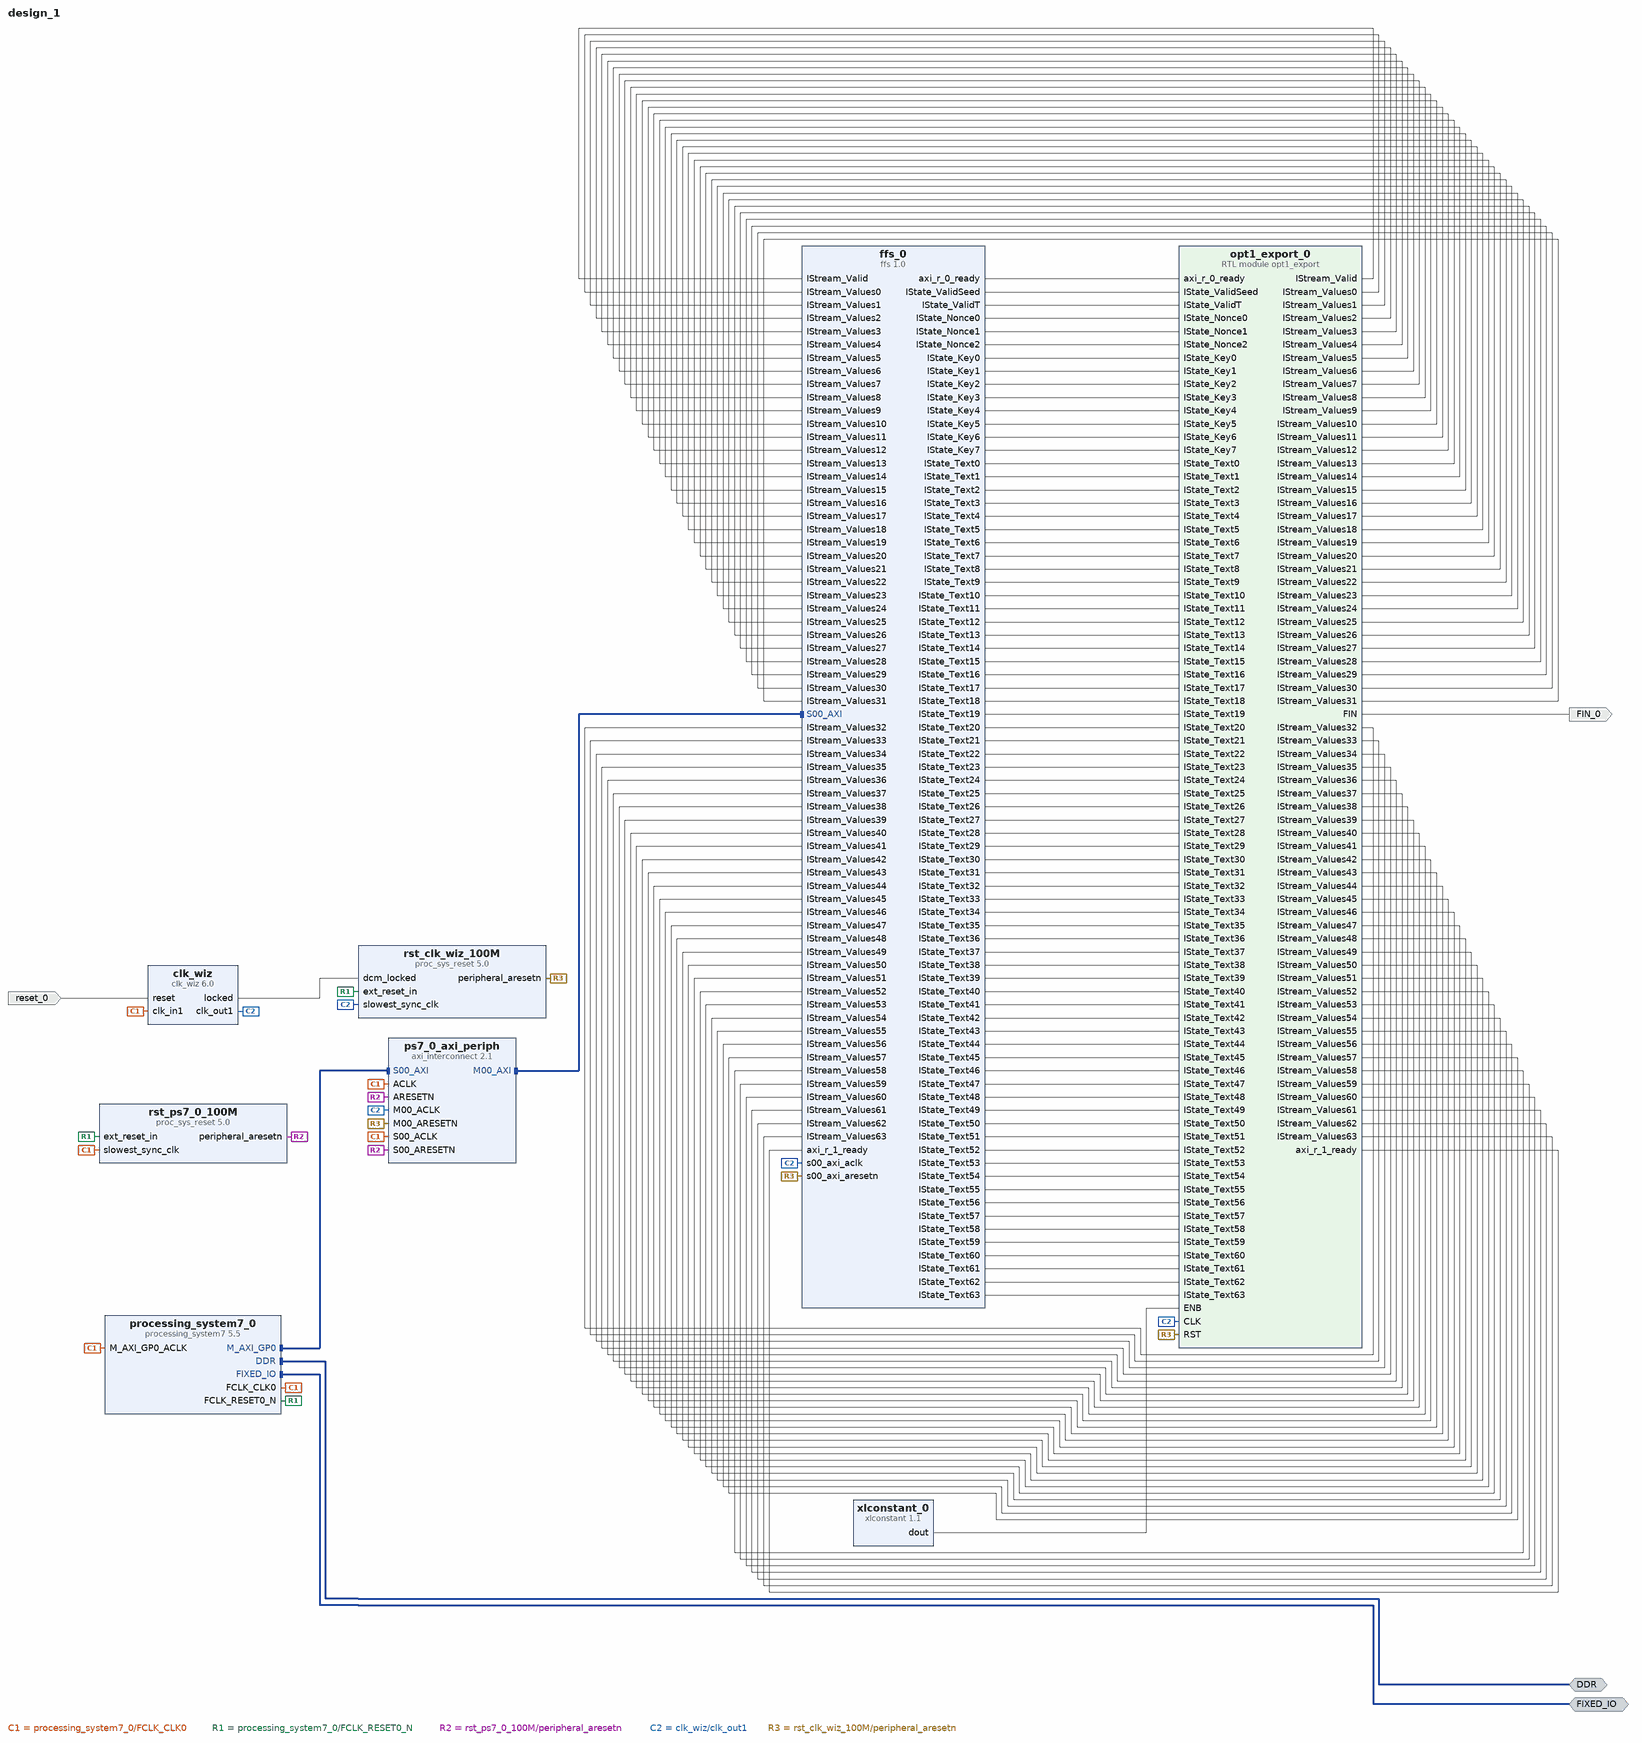
[diagram p0: block diagram of the top level]
# Vivado block design design_1, xc7z020clg484-1, Vivado 2020.2
create_bd_design design_1

create_bd_intf_port -mode Master -vlnv xilinx.com:interface:ddrx_rtl:1.0 DDR
create_bd_intf_port -mode Master -vlnv xilinx.com:display_processing_system7:fixedio_rtl:1.0 FIXED_IO
create_bd_port -dir O FIN_0
create_bd_port -dir I -type rst reset_0
set_property -dict {CONFIG.POLARITY ACTIVE_HIGH} [get_bd_ports reset_0]

create_bd_cell -type ip -vlnv user.org:user:ffs:1.0 ffs_0
create_bd_cell -type module -reference opt1_export opt1_export_0
create_bd_cell -type ip -vlnv xilinx.com:ip:xlconstant:1.1 xlconstant_0
create_bd_cell -type ip -vlnv xilinx.com:ip:processing_system7:5.5 processing_system7_0
set_property -dict [list \
  CONFIG.PCW_APU_PERIPHERAL_FREQMHZ 666.666667 \
  CONFIG.PCW_ENET0_ENET0_IO {MIO 16 .. 27} \
  CONFIG.PCW_ENET0_GRP_MDIO_ENABLE 1 \
  CONFIG.PCW_ENET0_GRP_MDIO_IO {MIO 52 .. 53} \
  CONFIG.PCW_ENET0_PERIPHERAL_ENABLE 1 \
  CONFIG.PCW_ENET0_RESET_ENABLE 0 \
  CONFIG.PCW_ENET_RESET_ENABLE 1 \
  CONFIG.PCW_ENET_RESET_SELECT {Share reset pin} \
  CONFIG.PCW_FPGA0_PERIPHERAL_FREQMHZ 100.000000 \
  CONFIG.PCW_FPGA1_PERIPHERAL_FREQMHZ 150.000000 \
  CONFIG.PCW_FPGA2_PERIPHERAL_FREQMHZ 50.000000 \
  CONFIG.PCW_GPIO_MIO_GPIO_ENABLE 1 \
  CONFIG.PCW_GPIO_MIO_GPIO_IO MIO \
  CONFIG.PCW_I2C_RESET_ENABLE 1 \
  CONFIG.PCW_PRESET_BANK1_VOLTAGE {LVCMOS 1.8V} \
  CONFIG.PCW_QSPI_GRP_SINGLE_SS_ENABLE 1 \
  CONFIG.PCW_QSPI_GRP_SINGLE_SS_IO {MIO 1 .. 6} \
  CONFIG.PCW_QSPI_PERIPHERAL_ENABLE 1 \
  CONFIG.PCW_QSPI_PERIPHERAL_FREQMHZ 200.000000 \
  CONFIG.PCW_QSPI_QSPI_IO {MIO 1 .. 6} \
  CONFIG.PCW_SD0_GRP_CD_ENABLE 1 \
  CONFIG.PCW_SD0_GRP_CD_IO {MIO 47} \
  CONFIG.PCW_SD0_GRP_WP_ENABLE 1 \
  CONFIG.PCW_SD0_GRP_WP_IO {MIO 46} \
  CONFIG.PCW_SD0_PERIPHERAL_ENABLE 1 \
  CONFIG.PCW_SD0_SD0_IO {MIO 40 .. 45} \
  CONFIG.PCW_SDIO_PERIPHERAL_FREQMHZ 50 \
  CONFIG.PCW_SINGLE_QSPI_DATA_MODE x4 \
  CONFIG.PCW_TTC0_PERIPHERAL_ENABLE 1 \
  CONFIG.PCW_TTC0_TTC0_IO EMIO \
  CONFIG.PCW_UART1_PERIPHERAL_ENABLE 1 \
  CONFIG.PCW_UART1_UART1_IO {MIO 48 .. 49} \
  CONFIG.PCW_UART_PERIPHERAL_FREQMHZ 50 \
  CONFIG.PCW_UIPARAM_DDR_FREQ_MHZ 533.333313 \
  CONFIG.PCW_UIPARAM_DDR_PARTNO {MT41J128M16 HA-15E} \
  CONFIG.PCW_USB0_PERIPHERAL_ENABLE 1 \
  CONFIG.PCW_USB0_RESET_ENABLE 0 \
  CONFIG.PCW_USB0_USB0_IO {MIO 28 .. 39} \
  CONFIG.PCW_USB_RESET_ENABLE 1 \
  CONFIG.PCW_USB_RESET_SELECT {Share reset pin} \
  CONFIG.preset ZedBoard \
] [get_bd_cells processing_system7_0]
# 221 more settings of processing_system7_0 are not shown: defaults, MIO pin electricals, DDR timing, and values the tool derives
create_bd_cell -type ip -vlnv xilinx.com:ip:axi_interconnect:2.1 ps7_0_axi_periph
set_property -dict {CONFIG.NUM_MI 1} [get_bd_cells ps7_0_axi_periph]
create_bd_cell -type ip -vlnv xilinx.com:ip:clk_wiz:6.0 clk_wiz
set_property -dict [list \
  CONFIG.CLKOUT1_JITTER 159.371 \
  CONFIG.CLKOUT1_PHASE_ERROR 98.575 \
  CONFIG.CLKOUT1_REQUESTED_OUT_FREQ 40 \
  CONFIG.MMCM_CLKFBOUT_MULT_F 10.000 \
  CONFIG.MMCM_CLKOUT0_DIVIDE_F 25.000 \
  CONFIG.MMCM_DIVCLK_DIVIDE 1 \
] [get_bd_cells clk_wiz]
create_bd_cell -type ip -vlnv xilinx.com:ip:proc_sys_reset:5.0 rst_ps7_0_100M
create_bd_cell -type ip -vlnv xilinx.com:ip:proc_sys_reset:5.0 rst_clk_wiz_100M

# ---- connections ----

connect_bd_intf_net [get_bd_intf_ports FIXED_IO] [get_bd_intf_pins processing_system7_0/FIXED_IO]
connect_bd_intf_net [get_bd_intf_ports DDR] [get_bd_intf_pins processing_system7_0/DDR]
connect_bd_intf_net [get_bd_intf_pins processing_system7_0/M_AXI_GP0] [get_bd_intf_pins ps7_0_axi_periph/S00_AXI]
connect_bd_intf_net [get_bd_intf_pins ps7_0_axi_periph/M00_AXI] [get_bd_intf_pins ffs_0/S00_AXI]
connect_bd_net [get_bd_pins ffs_0/axi_r_0_ready] [get_bd_pins opt1_export_0/axi_r_0_ready]
connect_bd_net [get_bd_pins opt1_export_0/IStream_Valid] [get_bd_pins ffs_0/IStream_Valid]
connect_bd_net [get_bd_pins opt1_export_0/IStream_Values0] [get_bd_pins ffs_0/IStream_Values0]
connect_bd_net [get_bd_pins opt1_export_0/IStream_Values1] [get_bd_pins ffs_0/IStream_Values1]
connect_bd_net [get_bd_pins opt1_export_0/IStream_Values2] [get_bd_pins ffs_0/IStream_Values2]
connect_bd_net [get_bd_pins opt1_export_0/IStream_Values3] [get_bd_pins ffs_0/IStream_Values3]
connect_bd_net [get_bd_pins opt1_export_0/IStream_Values4] [get_bd_pins ffs_0/IStream_Values4]
connect_bd_net [get_bd_pins opt1_export_0/IStream_Values5] [get_bd_pins ffs_0/IStream_Values5]
connect_bd_net [get_bd_pins opt1_export_0/IStream_Values6] [get_bd_pins ffs_0/IStream_Values6]
connect_bd_net [get_bd_pins opt1_export_0/IStream_Values7] [get_bd_pins ffs_0/IStream_Values7]
connect_bd_net [get_bd_pins opt1_export_0/IStream_Values8] [get_bd_pins ffs_0/IStream_Values8]
connect_bd_net [get_bd_pins opt1_export_0/IStream_Values9] [get_bd_pins ffs_0/IStream_Values9]
connect_bd_net [get_bd_pins opt1_export_0/IStream_Values10] [get_bd_pins ffs_0/IStream_Values10]
connect_bd_net [get_bd_pins opt1_export_0/IStream_Values11] [get_bd_pins ffs_0/IStream_Values11]
connect_bd_net [get_bd_pins opt1_export_0/IStream_Values12] [get_bd_pins ffs_0/IStream_Values12]
connect_bd_net [get_bd_pins opt1_export_0/IStream_Values13] [get_bd_pins ffs_0/IStream_Values13]
connect_bd_net [get_bd_pins opt1_export_0/IStream_Values14] [get_bd_pins ffs_0/IStream_Values14]
connect_bd_net [get_bd_pins opt1_export_0/IStream_Values15] [get_bd_pins ffs_0/IStream_Values15]
connect_bd_net [get_bd_pins opt1_export_0/IStream_Values16] [get_bd_pins ffs_0/IStream_Values16]
connect_bd_net [get_bd_pins opt1_export_0/IStream_Values17] [get_bd_pins ffs_0/IStream_Values17]
connect_bd_net [get_bd_pins opt1_export_0/IStream_Values18] [get_bd_pins ffs_0/IStream_Values18]
connect_bd_net [get_bd_pins opt1_export_0/IStream_Values19] [get_bd_pins ffs_0/IStream_Values19]
connect_bd_net [get_bd_pins opt1_export_0/IStream_Values20] [get_bd_pins ffs_0/IStream_Values20]
connect_bd_net [get_bd_pins opt1_export_0/IStream_Values21] [get_bd_pins ffs_0/IStream_Values21]
connect_bd_net [get_bd_pins opt1_export_0/IStream_Values22] [get_bd_pins ffs_0/IStream_Values22]
connect_bd_net [get_bd_pins opt1_export_0/IStream_Values23] [get_bd_pins ffs_0/IStream_Values23]
connect_bd_net [get_bd_pins opt1_export_0/IStream_Values24] [get_bd_pins ffs_0/IStream_Values24]
connect_bd_net [get_bd_pins opt1_export_0/IStream_Values25] [get_bd_pins ffs_0/IStream_Values25]
connect_bd_net [get_bd_pins opt1_export_0/IStream_Values26] [get_bd_pins ffs_0/IStream_Values26]
connect_bd_net [get_bd_pins opt1_export_0/IStream_Values27] [get_bd_pins ffs_0/IStream_Values27]
connect_bd_net [get_bd_pins opt1_export_0/IStream_Values28] [get_bd_pins ffs_0/IStream_Values28]
connect_bd_net [get_bd_pins opt1_export_0/IStream_Values29] [get_bd_pins ffs_0/IStream_Values29]
connect_bd_net [get_bd_pins opt1_export_0/IStream_Values30] [get_bd_pins ffs_0/IStream_Values30]
connect_bd_net [get_bd_pins opt1_export_0/IStream_Values31] [get_bd_pins ffs_0/IStream_Values31]
connect_bd_net [get_bd_pins opt1_export_0/IStream_Values32] [get_bd_pins ffs_0/IStream_Values32]
connect_bd_net [get_bd_pins opt1_export_0/IStream_Values33] [get_bd_pins ffs_0/IStream_Values33]
connect_bd_net [get_bd_pins opt1_export_0/IStream_Values34] [get_bd_pins ffs_0/IStream_Values34]
connect_bd_net [get_bd_pins opt1_export_0/IStream_Values35] [get_bd_pins ffs_0/IStream_Values35]
connect_bd_net [get_bd_pins opt1_export_0/IStream_Values36] [get_bd_pins ffs_0/IStream_Values36]
connect_bd_net [get_bd_pins opt1_export_0/IStream_Values37] [get_bd_pins ffs_0/IStream_Values37]
connect_bd_net [get_bd_pins opt1_export_0/IStream_Values38] [get_bd_pins ffs_0/IStream_Values38]
connect_bd_net [get_bd_pins opt1_export_0/IStream_Values39] [get_bd_pins ffs_0/IStream_Values39]
connect_bd_net [get_bd_pins opt1_export_0/IStream_Values40] [get_bd_pins ffs_0/IStream_Values40]
connect_bd_net [get_bd_pins opt1_export_0/IStream_Values41] [get_bd_pins ffs_0/IStream_Values41]
connect_bd_net [get_bd_pins opt1_export_0/IStream_Values42] [get_bd_pins ffs_0/IStream_Values42]
connect_bd_net [get_bd_pins opt1_export_0/IStream_Values43] [get_bd_pins ffs_0/IStream_Values43]
connect_bd_net [get_bd_pins opt1_export_0/IStream_Values44] [get_bd_pins ffs_0/IStream_Values44]
connect_bd_net [get_bd_pins opt1_export_0/IStream_Values45] [get_bd_pins ffs_0/IStream_Values45]
connect_bd_net [get_bd_pins opt1_export_0/IStream_Values46] [get_bd_pins ffs_0/IStream_Values46]
connect_bd_net [get_bd_pins opt1_export_0/IStream_Values47] [get_bd_pins ffs_0/IStream_Values47]
connect_bd_net [get_bd_pins opt1_export_0/IStream_Values48] [get_bd_pins ffs_0/IStream_Values48]
connect_bd_net [get_bd_pins opt1_export_0/IStream_Values49] [get_bd_pins ffs_0/IStream_Values49]
connect_bd_net [get_bd_pins opt1_export_0/IStream_Values50] [get_bd_pins ffs_0/IStream_Values50]
connect_bd_net [get_bd_pins opt1_export_0/IStream_Values51] [get_bd_pins ffs_0/IStream_Values51]
connect_bd_net [get_bd_pins opt1_export_0/IStream_Values52] [get_bd_pins ffs_0/IStream_Values52]
connect_bd_net [get_bd_pins opt1_export_0/IStream_Values53] [get_bd_pins ffs_0/IStream_Values53]
connect_bd_net [get_bd_pins opt1_export_0/IStream_Values54] [get_bd_pins ffs_0/IStream_Values54]
connect_bd_net [get_bd_pins opt1_export_0/IStream_Values55] [get_bd_pins ffs_0/IStream_Values55]
connect_bd_net [get_bd_pins opt1_export_0/IStream_Values56] [get_bd_pins ffs_0/IStream_Values56]
connect_bd_net [get_bd_pins opt1_export_0/IStream_Values57] [get_bd_pins ffs_0/IStream_Values57]
connect_bd_net [get_bd_pins opt1_export_0/IStream_Values58] [get_bd_pins ffs_0/IStream_Values58]
connect_bd_net [get_bd_pins opt1_export_0/IStream_Values59] [get_bd_pins ffs_0/IStream_Values59]
connect_bd_net [get_bd_pins opt1_export_0/IStream_Values60] [get_bd_pins ffs_0/IStream_Values60]
connect_bd_net [get_bd_pins opt1_export_0/IStream_Values61] [get_bd_pins ffs_0/IStream_Values61]
connect_bd_net [get_bd_pins opt1_export_0/IStream_Values62] [get_bd_pins ffs_0/IStream_Values62]
connect_bd_net [get_bd_pins opt1_export_0/IStream_Values63] [get_bd_pins ffs_0/IStream_Values63]
connect_bd_net [get_bd_pins ffs_0/IState_ValidSeed] [get_bd_pins opt1_export_0/IState_ValidSeed]
connect_bd_net [get_bd_pins ffs_0/IState_ValidT] [get_bd_pins opt1_export_0/IState_ValidT]
connect_bd_net [get_bd_pins ffs_0/IState_Nonce0] [get_bd_pins opt1_export_0/IState_Nonce0]
connect_bd_net [get_bd_pins ffs_0/IState_Nonce1] [get_bd_pins opt1_export_0/IState_Nonce1]
connect_bd_net [get_bd_pins ffs_0/IState_Nonce2] [get_bd_pins opt1_export_0/IState_Nonce2]
connect_bd_net [get_bd_pins ffs_0/IState_Key0] [get_bd_pins opt1_export_0/IState_Key0]
connect_bd_net [get_bd_pins ffs_0/IState_Key1] [get_bd_pins opt1_export_0/IState_Key1]
connect_bd_net [get_bd_pins ffs_0/IState_Key2] [get_bd_pins opt1_export_0/IState_Key2]
connect_bd_net [get_bd_pins ffs_0/IState_Key3] [get_bd_pins opt1_export_0/IState_Key3]
connect_bd_net [get_bd_pins ffs_0/IState_Key4] [get_bd_pins opt1_export_0/IState_Key4]
connect_bd_net [get_bd_pins ffs_0/IState_Key5] [get_bd_pins opt1_export_0/IState_Key5]
connect_bd_net [get_bd_pins ffs_0/IState_Key6] [get_bd_pins opt1_export_0/IState_Key6]
connect_bd_net [get_bd_pins ffs_0/IState_Key7] [get_bd_pins opt1_export_0/IState_Key7]
connect_bd_net [get_bd_pins ffs_0/IState_Text0] [get_bd_pins opt1_export_0/IState_Text0]
connect_bd_net [get_bd_pins ffs_0/IState_Text1] [get_bd_pins opt1_export_0/IState_Text1]
connect_bd_net [get_bd_pins ffs_0/IState_Text2] [get_bd_pins opt1_export_0/IState_Text2]
connect_bd_net [get_bd_pins ffs_0/IState_Text3] [get_bd_pins opt1_export_0/IState_Text3]
connect_bd_net [get_bd_pins ffs_0/IState_Text4] [get_bd_pins opt1_export_0/IState_Text4]
connect_bd_net [get_bd_pins ffs_0/IState_Text5] [get_bd_pins opt1_export_0/IState_Text5]
connect_bd_net [get_bd_pins ffs_0/IState_Text6] [get_bd_pins opt1_export_0/IState_Text6]
connect_bd_net [get_bd_pins ffs_0/IState_Text7] [get_bd_pins opt1_export_0/IState_Text7]
connect_bd_net [get_bd_pins ffs_0/IState_Text8] [get_bd_pins opt1_export_0/IState_Text8]
connect_bd_net [get_bd_pins ffs_0/IState_Text9] [get_bd_pins opt1_export_0/IState_Text9]
connect_bd_net [get_bd_pins ffs_0/IState_Text10] [get_bd_pins opt1_export_0/IState_Text10]
connect_bd_net [get_bd_pins ffs_0/IState_Text11] [get_bd_pins opt1_export_0/IState_Text11]
connect_bd_net [get_bd_pins ffs_0/IState_Text12] [get_bd_pins opt1_export_0/IState_Text12]
connect_bd_net [get_bd_pins ffs_0/IState_Text13] [get_bd_pins opt1_export_0/IState_Text13]
connect_bd_net [get_bd_pins ffs_0/IState_Text14] [get_bd_pins opt1_export_0/IState_Text14]
connect_bd_net [get_bd_pins ffs_0/IState_Text15] [get_bd_pins opt1_export_0/IState_Text15]
connect_bd_net [get_bd_pins ffs_0/IState_Text16] [get_bd_pins opt1_export_0/IState_Text16]
connect_bd_net [get_bd_pins ffs_0/IState_Text17] [get_bd_pins opt1_export_0/IState_Text17]
connect_bd_net [get_bd_pins ffs_0/IState_Text18] [get_bd_pins opt1_export_0/IState_Text18]
connect_bd_net [get_bd_pins ffs_0/IState_Text19] [get_bd_pins opt1_export_0/IState_Text19]
connect_bd_net [get_bd_pins ffs_0/IState_Text20] [get_bd_pins opt1_export_0/IState_Text20]
connect_bd_net [get_bd_pins ffs_0/IState_Text21] [get_bd_pins opt1_export_0/IState_Text21]
connect_bd_net [get_bd_pins ffs_0/IState_Text22] [get_bd_pins opt1_export_0/IState_Text22]
connect_bd_net [get_bd_pins ffs_0/IState_Text23] [get_bd_pins opt1_export_0/IState_Text23]
connect_bd_net [get_bd_pins ffs_0/IState_Text24] [get_bd_pins opt1_export_0/IState_Text24]
connect_bd_net [get_bd_pins ffs_0/IState_Text25] [get_bd_pins opt1_export_0/IState_Text25]
connect_bd_net [get_bd_pins ffs_0/IState_Text26] [get_bd_pins opt1_export_0/IState_Text26]
connect_bd_net [get_bd_pins ffs_0/IState_Text27] [get_bd_pins opt1_export_0/IState_Text27]
connect_bd_net [get_bd_pins ffs_0/IState_Text28] [get_bd_pins opt1_export_0/IState_Text28]
connect_bd_net [get_bd_pins ffs_0/IState_Text29] [get_bd_pins opt1_export_0/IState_Text29]
connect_bd_net [get_bd_pins ffs_0/IState_Text30] [get_bd_pins opt1_export_0/IState_Text30]
connect_bd_net [get_bd_pins ffs_0/IState_Text31] [get_bd_pins opt1_export_0/IState_Text31]
connect_bd_net [get_bd_pins ffs_0/IState_Text32] [get_bd_pins opt1_export_0/IState_Text32]
connect_bd_net [get_bd_pins ffs_0/IState_Text33] [get_bd_pins opt1_export_0/IState_Text33]
connect_bd_net [get_bd_pins ffs_0/IState_Text34] [get_bd_pins opt1_export_0/IState_Text34]
connect_bd_net [get_bd_pins ffs_0/IState_Text35] [get_bd_pins opt1_export_0/IState_Text35]
connect_bd_net [get_bd_pins ffs_0/IState_Text36] [get_bd_pins opt1_export_0/IState_Text36]
connect_bd_net [get_bd_pins ffs_0/IState_Text37] [get_bd_pins opt1_export_0/IState_Text37]
connect_bd_net [get_bd_pins ffs_0/IState_Text38] [get_bd_pins opt1_export_0/IState_Text38]
connect_bd_net [get_bd_pins ffs_0/IState_Text39] [get_bd_pins opt1_export_0/IState_Text39]
connect_bd_net [get_bd_pins ffs_0/IState_Text40] [get_bd_pins opt1_export_0/IState_Text40]
connect_bd_net [get_bd_pins ffs_0/IState_Text41] [get_bd_pins opt1_export_0/IState_Text41]
connect_bd_net [get_bd_pins ffs_0/IState_Text42] [get_bd_pins opt1_export_0/IState_Text42]
connect_bd_net [get_bd_pins ffs_0/IState_Text43] [get_bd_pins opt1_export_0/IState_Text43]
connect_bd_net [get_bd_pins ffs_0/IState_Text44] [get_bd_pins opt1_export_0/IState_Text44]
connect_bd_net [get_bd_pins ffs_0/IState_Text45] [get_bd_pins opt1_export_0/IState_Text45]
connect_bd_net [get_bd_pins ffs_0/IState_Text46] [get_bd_pins opt1_export_0/IState_Text46]
connect_bd_net [get_bd_pins ffs_0/IState_Text47] [get_bd_pins opt1_export_0/IState_Text47]
connect_bd_net [get_bd_pins ffs_0/IState_Text48] [get_bd_pins opt1_export_0/IState_Text48]
connect_bd_net [get_bd_pins ffs_0/IState_Text49] [get_bd_pins opt1_export_0/IState_Text49]
connect_bd_net [get_bd_pins ffs_0/IState_Text50] [get_bd_pins opt1_export_0/IState_Text50]
connect_bd_net [get_bd_pins ffs_0/IState_Text51] [get_bd_pins opt1_export_0/IState_Text51]
connect_bd_net [get_bd_pins ffs_0/IState_Text52] [get_bd_pins opt1_export_0/IState_Text52]
connect_bd_net [get_bd_pins ffs_0/IState_Text53] [get_bd_pins opt1_export_0/IState_Text53]
connect_bd_net [get_bd_pins ffs_0/IState_Text54] [get_bd_pins opt1_export_0/IState_Text54]
connect_bd_net [get_bd_pins ffs_0/IState_Text55] [get_bd_pins opt1_export_0/IState_Text55]
connect_bd_net [get_bd_pins ffs_0/IState_Text56] [get_bd_pins opt1_export_0/IState_Text56]
connect_bd_net [get_bd_pins ffs_0/IState_Text57] [get_bd_pins opt1_export_0/IState_Text57]
connect_bd_net [get_bd_pins ffs_0/IState_Text58] [get_bd_pins opt1_export_0/IState_Text58]
connect_bd_net [get_bd_pins ffs_0/IState_Text59] [get_bd_pins opt1_export_0/IState_Text59]
connect_bd_net [get_bd_pins ffs_0/IState_Text60] [get_bd_pins opt1_export_0/IState_Text60]
connect_bd_net [get_bd_pins ffs_0/IState_Text61] [get_bd_pins opt1_export_0/IState_Text61]
connect_bd_net [get_bd_pins ffs_0/IState_Text62] [get_bd_pins opt1_export_0/IState_Text62]
connect_bd_net [get_bd_pins ffs_0/IState_Text63] [get_bd_pins opt1_export_0/IState_Text63]
connect_bd_net [get_bd_pins opt1_export_0/axi_r_1_ready] [get_bd_pins ffs_0/axi_r_1_ready]
connect_bd_net [get_bd_pins opt1_export_0/FIN] [get_bd_ports FIN_0]
connect_bd_net [get_bd_pins xlconstant_0/dout] [get_bd_pins opt1_export_0/ENB]
connect_bd_net [get_bd_pins processing_system7_0/FCLK_CLK0] \
  [get_bd_pins processing_system7_0/M_AXI_GP0_ACLK] [get_bd_pins ps7_0_axi_periph/S00_ACLK] \
  [get_bd_pins rst_ps7_0_100M/slowest_sync_clk] [get_bd_pins ps7_0_axi_periph/ACLK] [get_bd_pins clk_wiz/clk_in1]
connect_bd_net [get_bd_pins processing_system7_0/FCLK_RESET0_N] [get_bd_pins rst_ps7_0_100M/ext_reset_in] [get_bd_pins rst_clk_wiz_100M/ext_reset_in]
connect_bd_net [get_bd_pins rst_ps7_0_100M/peripheral_aresetn] [get_bd_pins ps7_0_axi_periph/S00_ARESETN] [get_bd_pins ps7_0_axi_periph/ARESETN]
connect_bd_net [get_bd_pins clk_wiz/clk_out1] \
  [get_bd_pins ffs_0/s00_axi_aclk] [get_bd_pins ps7_0_axi_periph/M00_ACLK] [get_bd_pins rst_clk_wiz_100M/slowest_sync_clk] \
  [get_bd_pins opt1_export_0/CLK]
connect_bd_net [get_bd_pins clk_wiz/locked] [get_bd_pins rst_clk_wiz_100M/dcm_locked]
connect_bd_net [get_bd_pins rst_clk_wiz_100M/peripheral_aresetn] \
  [get_bd_pins ffs_0/s00_axi_aresetn] [get_bd_pins ps7_0_axi_periph/M00_ARESETN] [get_bd_pins opt1_export_0/RST]
connect_bd_net -net reset_0_1 [get_bd_ports reset_0] [get_bd_pins clk_wiz/reset]

# ---- address map ----
assign_bd_address -offset 0x43C00000 -range 64K -target_address_space [get_bd_addr_spaces processing_system7_0/Data] [get_bd_addr_segs ffs_0/S00_AXI/S00_AXI_reg]

validate_bd_design
save_bd_design
